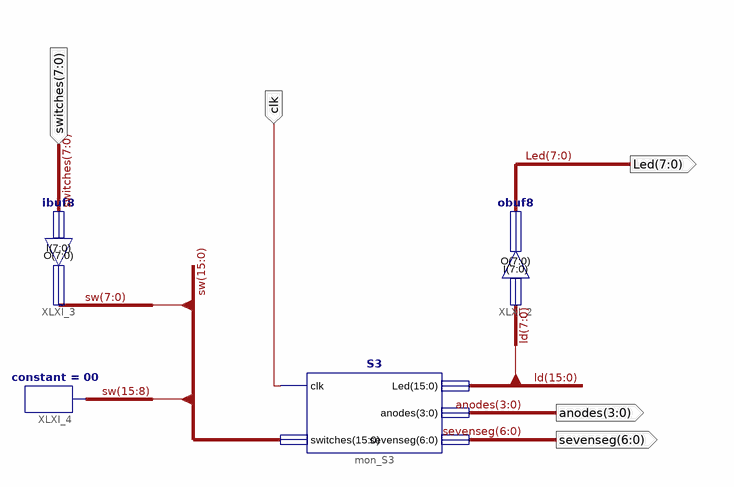
[diagram p0: schematic sheet 1]
// Xilinx ISE schematic toplevel.sch (spartan3e) as structural Verilog: 4 symbols, 5 ports
module toplevel (
  input  clk,
  input  [7:0] switches,
  output [3:0] anodes,
  output [6:0] sevenseg,
  output [7:0] Led
);

  wire [15:0] ld, sw;

  S3 mon_S3 (.clk(clk), .switches(sw), .Led(ld), .anodes(anodes), .sevenseg(sevenseg));
  obuf8 XLXI_2 (.I(ld[7:0]), .O(Led));
  ibuf8 XLXI_3 (.I(switches), .O(sw[7:0]));
  constant #(.CValue("00")) XLXI_4 (.O(sw[15:8]));
endmodule
